# Altium schematic sheet Isolation-Buffers.SchDoc
size B; SheetNumber: 9; SheetTotal: 12
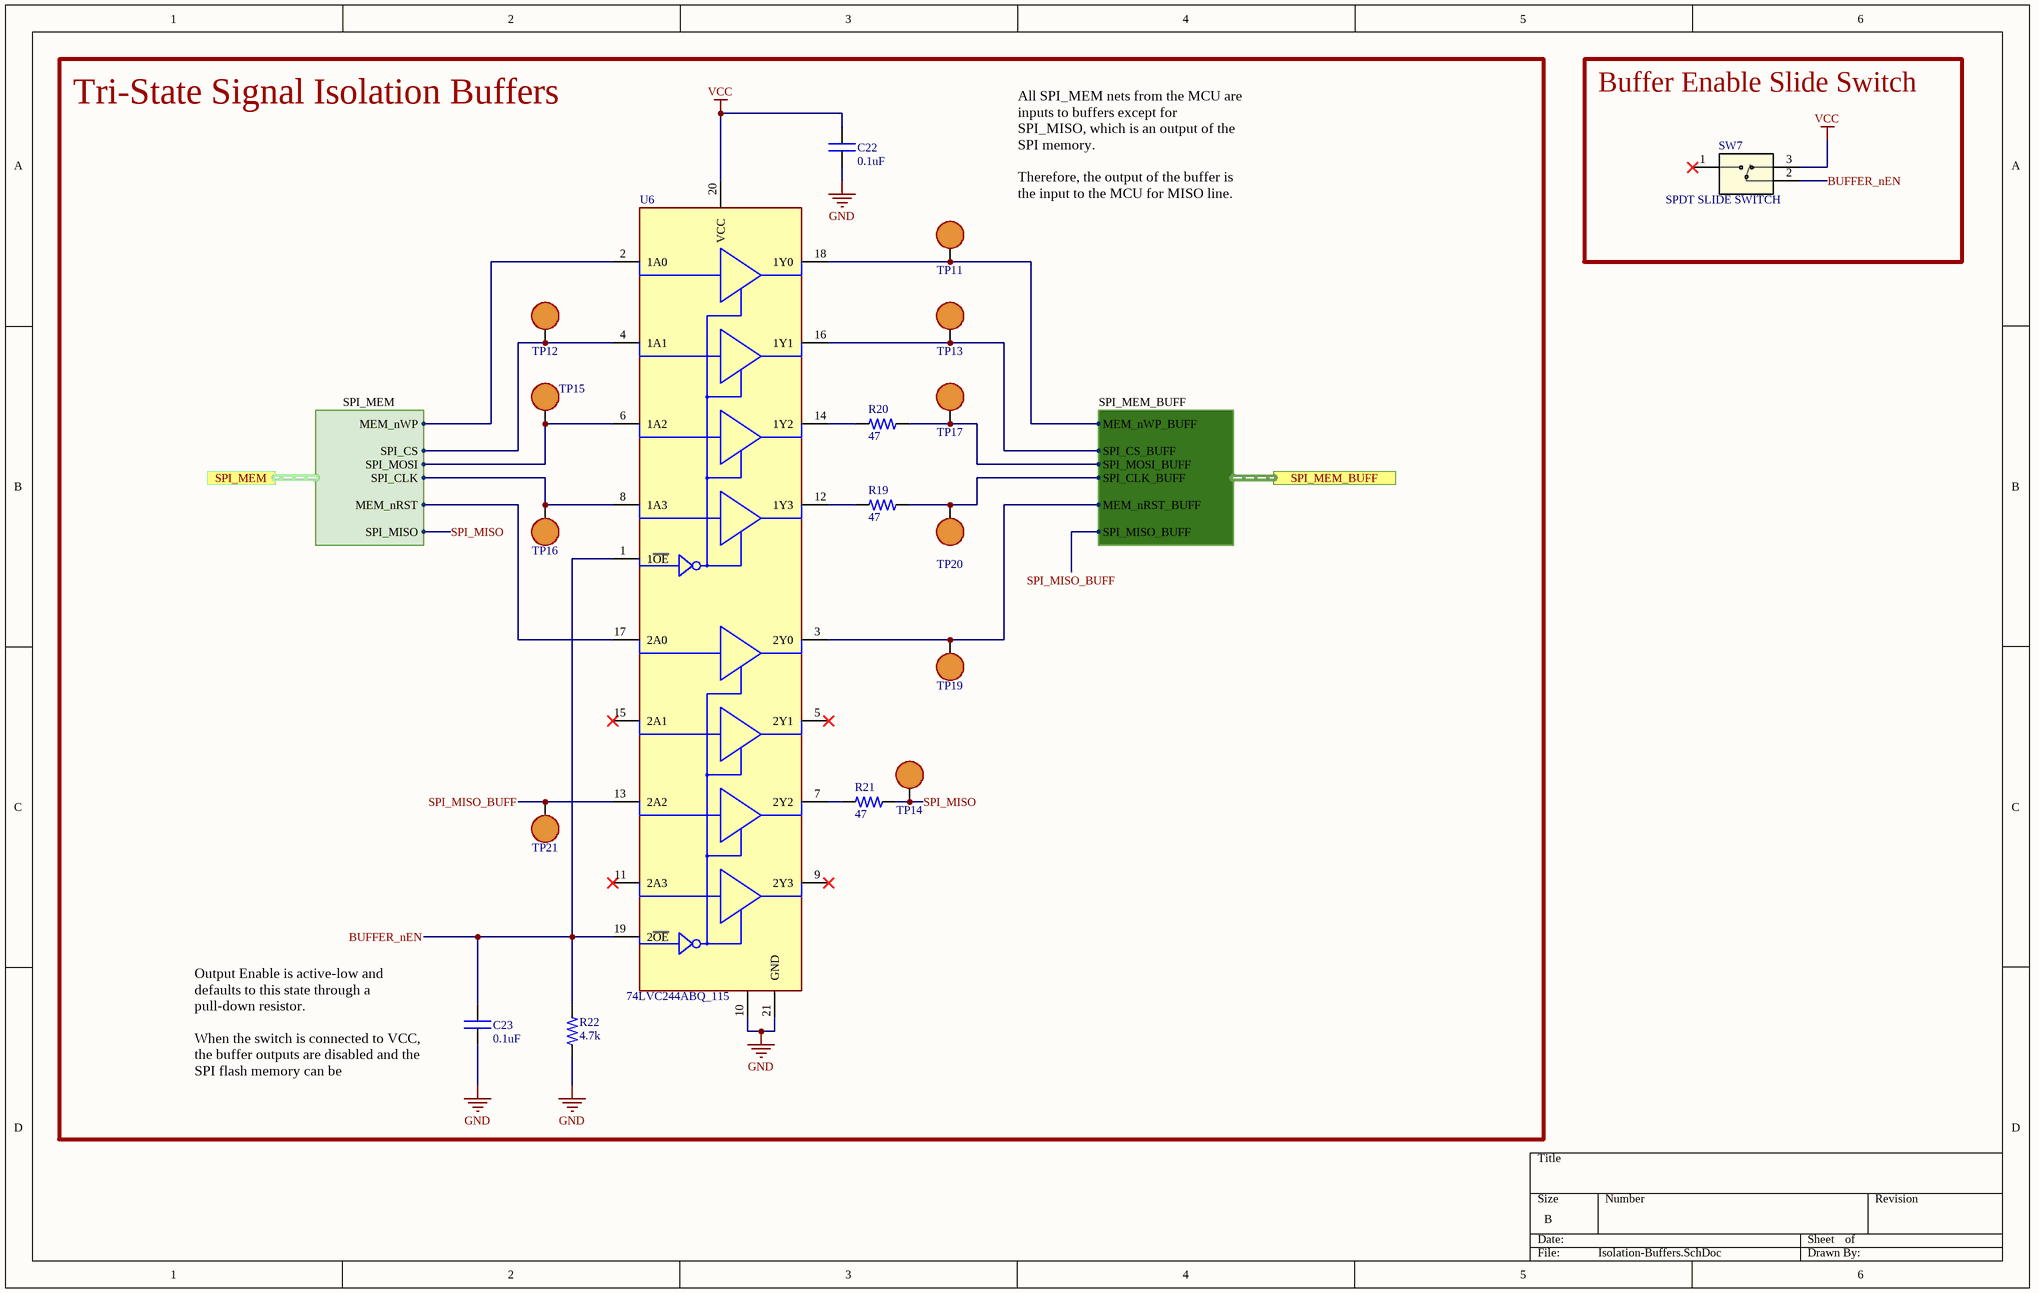
[diagram p0: Isolation-Buffers.SchDoc]

## Parts
C22  value 0.1uF  [0402C]  (hidden comment: CAP)
C23  value 0.1uF  [0402C]  (hidden comment: CAP)
R19  value 47  [0402R]  (hidden comment: RES)
R20  value 47  [0402R]  (hidden comment: RES)
R21  value 47  [0402R]  (hidden comment: RES)
R22  value 4.7k  [0402R]  (hidden comment: RES)
SW7  SPDT SLIDE SWITCH  [JS102011SCQN]
TP11  RCWCTE  [RCWCTE]  (value not drawn)
TP12  RCWCTE  [RCWCTE]  (value not drawn)
TP13  RCWCTE  [RCWCTE]  (value not drawn)
TP14  RCWCTE  [RCWCTE]  (value not drawn)
TP15  RCWCTE  [RCWCTE]  (value not drawn)
TP16  RCWCTE  [RCWCTE]  (value not drawn)
TP17  RCWCTE  [RCWCTE]  (value not drawn)
TP19  RCWCTE  [RCWCTE]  (value not drawn)
TP20  RCWCTE  [RCWCTE]  (value not drawn)
TP21  RCWCTE  [RCWCTE]  (value not drawn)
U6  74LVC244ABQ_115  [20-VFQN-EP]

## Blocks framed on the sheet
Tri-State Signal Isolation Buffers: C22 C23 R19-R22 TP11-TP17 TP19-TP21 U6
Buffer Enable Slide Switch: SW7

## Ports
SPI_MEM (harness SPI_MEM, see Brain-PCB_MASTER[3C], MCU[1A]), SPI_MEM_BUFF (harness SPI_MEM_BUFF, see Brain-PCB_MASTER[2C], Flash-Memory[4A])

## Harnesses
SPI_MEM: SPI_CLK, SPI_MISO, SPI_MOSI, SPI_CS, MEM_nWP, MEM_nRST
SPI_MEM_BUFF: SPI_CLK_BUFF, SPI_MISO_BUFF, SPI_MOSI_BUFF, SPI_CS_BUFF, MEM_nWP_BUFF, MEM_nRST_BUFF

## Nets
GND: C22.2 C23.1 R22.1 U6.10(GND) U6.21(GND)
VCC: C22.1 SW7.3 U6.20(VCC)
BUFFER_nEN: C23.2 R22.2 SW7.2 U6.1(1~{OE}) U6.19(2~{OE})
SPI_MISO: R21.1 TP14.1 ; port SPI_MEM.SPI_MISO
SPI_MISO_BUFF: TP21.1 U6.13(2A2) ; port SPI_MEM_BUFF.SPI_MISO_BUFF
NetR19_1: R19.1 TP20.1 ; port SPI_MEM_BUFF.SPI_CLK_BUFF
NetR19_2: R19.2 U6.12(1Y3)
NetR20_1: R20.1 TP17.1 ; port SPI_MEM_BUFF.SPI_MOSI_BUFF
NetR20_2: R20.2 U6.14(1Y2)
NetR21_2: R21.2 U6.7(2Y2)
NetTP11_1: TP11.1 U6.18(1Y0) ; port SPI_MEM_BUFF.MEM_nWP_BUFF
NetTP12_1: TP12.1 U6.4(1A1) ; port SPI_MEM.SPI_CS
NetTP13_1: TP13.1 U6.16(1Y1) ; port SPI_MEM_BUFF.SPI_CS_BUFF
NetTP15_1: TP15.1 U6.6(1A2) ; port SPI_MEM.SPI_MOSI
NetTP16_1: TP16.1 U6.8(1A3) ; port SPI_MEM.SPI_CLK
NetTP19_1: TP19.1 U6.3(2Y0) ; port SPI_MEM_BUFF.MEM_nRST_BUFF
NetU6_2: U6.2(1A0) ; port SPI_MEM.MEM_nWP
NetU6_17: U6.17(2A0) ; port SPI_MEM.MEM_nRST

Not connected (* = marked no-connect by the designer): SW7 1*; U6 5(2Y1)* 9(2Y3)* 11(2A3)* 15(2A1)*

## Notes on the sheet
- All SPI_MEM nets from the MCU are inputs to buffers except for SPI_MISO, which is an output of the SPI memory.
  Therefore, the output of the buffer is the input to the MCU for MISO line.
- Output Enable is active-low and defaults to this state through a pull-down resistor.
  When the switch is connected to VCC, the buffer outputs are disabled and the SPI flash memory can be programmed.

## Library data of the parts
C22 C23 = CAP: Capacitor; MFR: Murata Electronics; MFR PN: GRM155R71C104KA88J; Type: SMD; Vendor: *; Vendor PN: *; Vendor Link: *
R19-R21 = RES: Resistor; MFR PN: RC0402FR-0747RL; MFR: YAGEO; Vendor: *; Vendor PN: *; Vendor Link: *; Type: SMD
R22 = RES: Resistor; MFR PN: AC0402FR-134K7L; MFR: YAGEO; Vendor: *; Vendor PN: *; Vendor Link: *; Type: SMD
SW7 = SPDT SLIDE SWITCH: MFR: C&K; MFR PN: JS102011SCQN; Type: SMD
TP11-TP17 TP19-TP21 = TEST POINT: Test Point, Surface Mount; MFR: KOA Speer Electronics, Inc.; MFR PN: RCWCTE; Type: SMD
U6 = TRI-STATE BUFFERS 8 CIRC: NXP 74LVC244ABQ,115 Octal Buffer & Line Driver, 3-State, 1.2  3.6 V, 20-Pin DHVQFN; MFR: Nexperia; MFR PN: 74LVC244ABQ,115; Value: *; Type: SMD